# EAGLE design B301D (EAGLE 6.6.0)
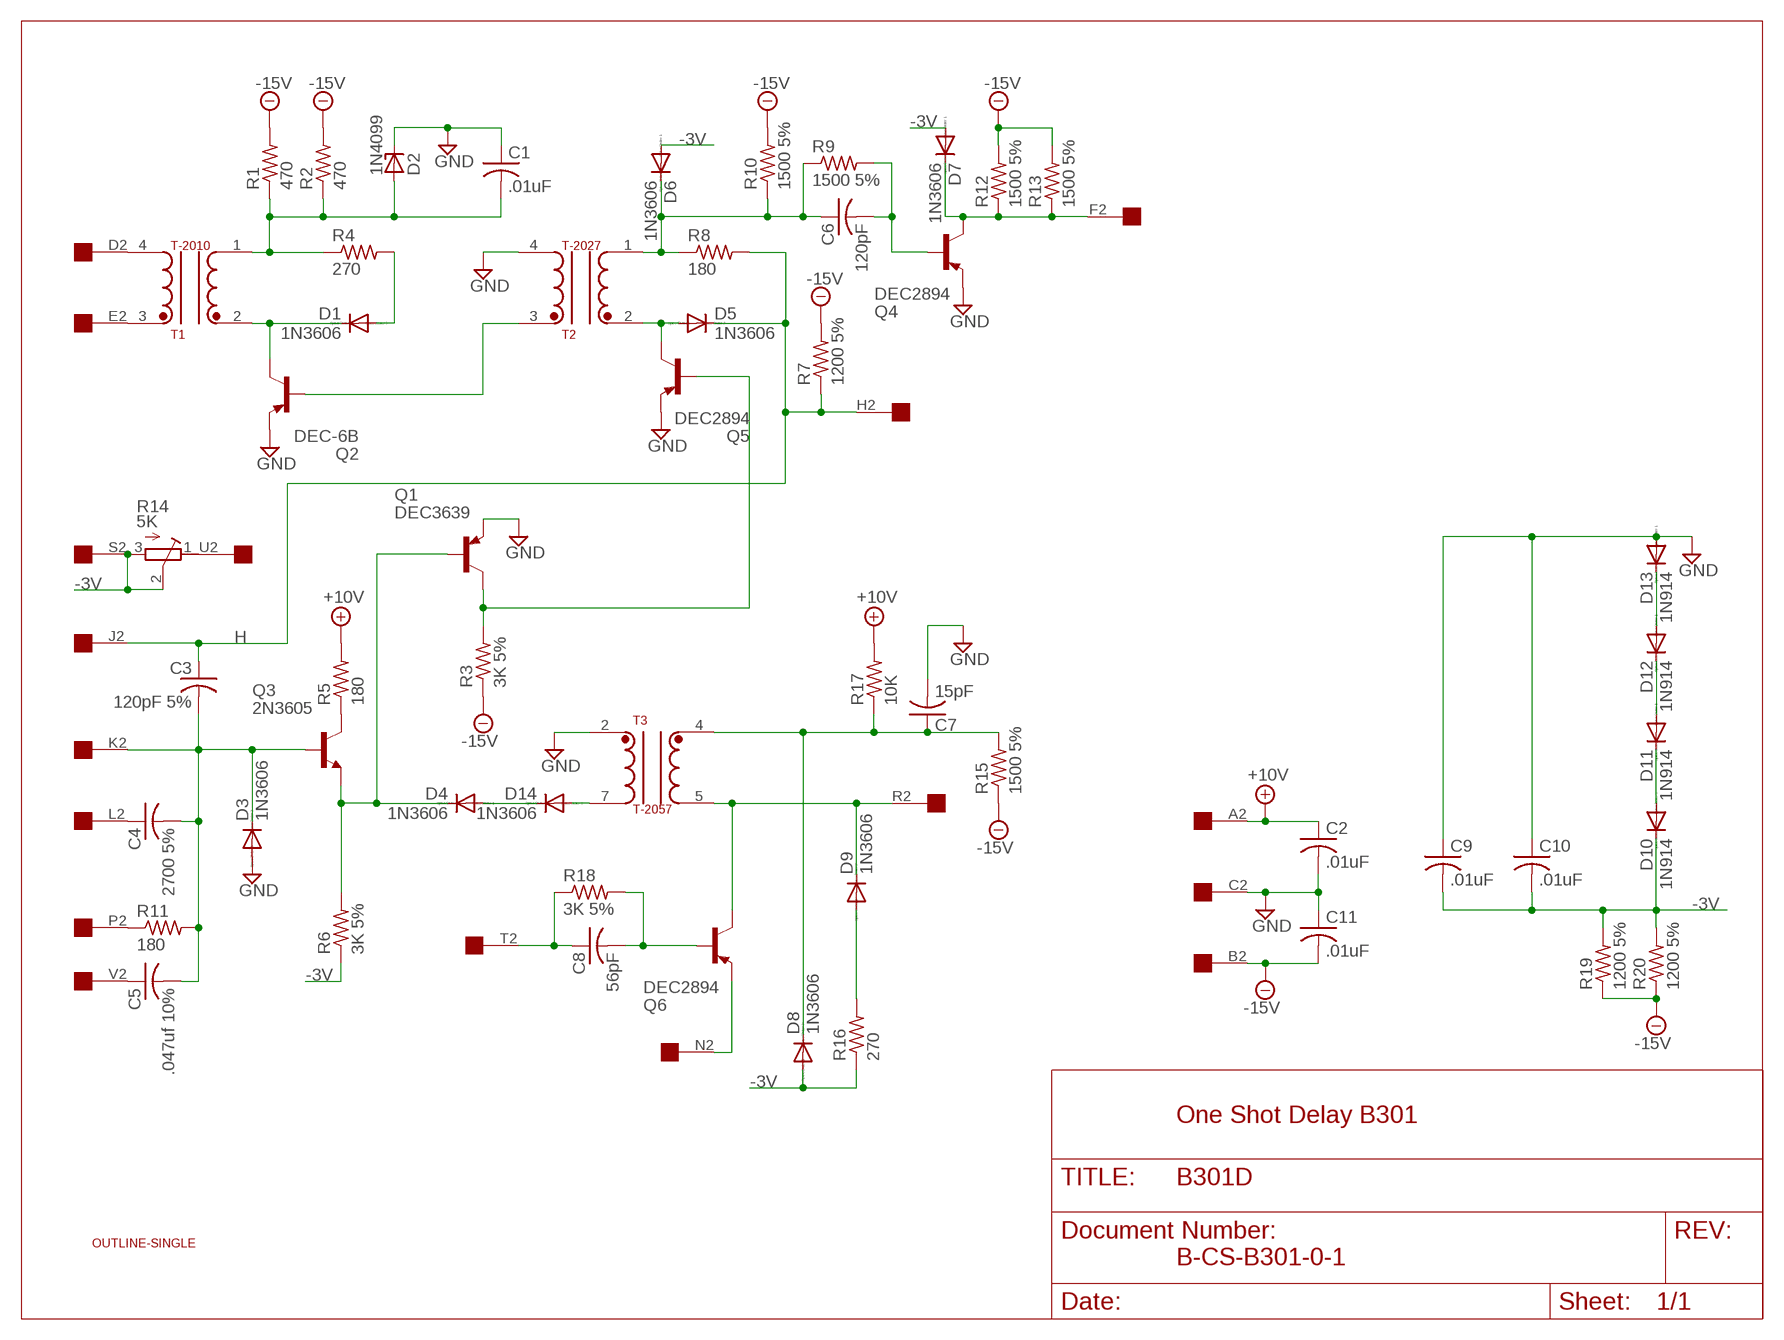
[diagram p0: schematic, sheet 1]

## Parts
C1  .01uF  C-US  [C063-025X075]
C2  .01uF  C-US  [C063-025X075]
C3  120pF 5%  C-US150-054X183  [C150-054X183]
C4  2700 5%  C-US102-043X133  [C102-043X133]
C5  .047uf 10%  C-US225-062X268  [C225-062X268]
C6  120pF  C-US150-054X183  [C150-054X183]
C7  15pF  C-US150-054X183  [C150-054X183]
C8  56pF  C-US150-054X183  [C150-054X183]
C9  .01uF  C-US  [C063-025X075]
C10  .01uF  C-US  [C063-025X075]
C11  .01uF  C-US  [C063-025X075]
D1  1N3606  1N4148DO35-10  [DO35-10]
D2  1N4099  ZENER-DIODEDO35Z10  [DO35Z10]
D3  1N3606  1N4148DO35-10  [DO35-10]
D4  1N3606  1N4148DO35-10  [DO35-10]
D5  1N3606  1N4148DO35-10  [DO35-10]
D6  1N3606  1N4148DO35-10  [DO35-10]
D7  1N3606  1N4148DO35-10  [DO35-10]
D8  1N3606  1N4148DO35-10  [DO35-10]
D9  1N3606  1N4148DO35-10  [DO35-10]
D10  1N914  1N4148DO35-10  [DO35-10]
D11  1N914  1N4148DO35-10  [DO35-10]
D12  1N914  1N4148DO35-10  [DO35-10]
D13  1N914  1N4148DO35-10  [DO35-10]
D14  1N3606  1N4148DO35-10  [DO35-10]
Q1  DEC3639  2N2904  [TO39]
Q2  DEC-6B  2N2904  [TO39]
Q3  2N3605  2N2102-NPN-TO39-EBC  [TO39]
Q4  DEC2894  2N2904  [TO39]
Q5  DEC2894  2N2904  [TO39]
Q6  DEC2894  2N2904  [TO39]
R1  470  R-US_0207/10  [0207/10]
R2  470  R-US_0207/10  [0207/10]
R3  3K 5%  R-US_0207/10  [0207/10]
R4  270  R-US_0207/10  [0207/10]
R5  180  R-US_0207/10  [0207/10]
R6  3K 5%  R-US_0207/10  [0207/10]
R7  1200 5%  R-US_0207/10  [0207/10]
R8  180  R-US_0207/10  [0207/10]
R9  1500 5%  R-US_0207/10  [0207/10]
R10  1500 5%  R-US_0207/10  [0207/10]
R11  180  R-US_0207/10  [0207/10]
R12  1500 5%  R-US_0207/10  [0207/10]
R13  1500 5%  R-US_0207/10  [0207/10]
R14  5K  275P  [3006Y]
R15  1500 5%  R-US_0207/10  [0207/10]
R16  270  R-US_0207/10  [0207/10]
R17  10K  R-US_0207/10  [0207/10]
R18  3K 5%  R-US_0207/10  [0207/10]
R19  1200 5%  R-US_0207/10  [0207/10]
R20  1200 5%  R-US_0207/10  [0207/10]
T1  T-2010  [TRANSFORMER2]
T2  T-2027  T-2010  [TRANSFORMER2]
T3  T-2057  T-2037  [TRANSFORMER]
U$1  OUTLINE-SINGLE  [SINGLE]
U$2  EDGE-1  [EDGE-CON1]

## Nets
+10V: C2.1 R5.2 R17.2 U$2.A2
-3V [Supply]: C9.2 C10.2 D6.A D7.A D8.A D10.C R6.1 R14.2(S) R14.3(E) R16.1 R19.2 R20.2 U$2.S2
-15V [Supply]: C11.2 R1.2 R2.2 R3.1 R7.2 R10.2 R12.2 R13.2 R15.1 R19.1 R20.1 U$2.B2
GND [Supply]: C1.1 C2.2 C7.2 C9.1 C10.1 C11.1 D2.C D3.A D13.A Q1.1(E) Q2.1(E) Q4.1(E) Q5.1(E) T2.4 T3.2 U$2.C2
H: C3.1 D5.C R7.1 R8.2 U$2.H2 U$2.J2
N$1: D7.C Q4.3(C) R12.1 R13.1 U$2.F2
N$2: C6.2 Q4.2(B) R9.2
N$3: D4.C Q1.2(B) Q3.1(E) R6.2
N$4: C3.2 C4.2 C5.2 D3.C Q3.2(B) R11.2 U$2.K2
N$5 [Supply]: R14.1(A) U$2.U2
N$6: C4.1 U$2.L2
N$7: C5.1 U$2.V2
N$8: Q2.2(B) T2.3
N$9: D1.C Q2.3(C) T1.2
N$10: R11.1 U$2.P2
N$11: Q3.3(C) R5.1
N$12: C1.2 D2.A R1.1 R2.1 R4.1 T1.1
N$13: D1.A R4.2
N$14: D5.A Q5.3(C) T2.2
N$15: D4.A D14.C
N$16: C6.1 D6.C R8.1 R9.1 R10.1 T2.1
N$17: Q1.3(C) Q5.2(B) R3.2
N$18: D14.A T3.7
N$19: D9.C Q6.3(C) T3.5 U$2.R2
N$20: Q6.1(E) U$2.N2
N$21: C8.2 Q6.2(B) R18.2
N$22: C8.1 R18.1 U$2.T2
N$23 [Supply]: C7.1 D8.C R15.2 R17.1 T3.4
N$24: D9.A R16.2
N$26: D12.A D13.C
N$27: D11.A D12.C
N$29: D10.A D11.C
N$41: T1.3 U$2.E2
N$42: T1.4 U$2.D2
Unconnected: U$2.M2

## Notes on the sheet
- One Shot Delay B301
- B-CS-B301-0-1

## Library data of the parts
C1 C2 C9-C11 = dec-con:C-US: Capacitors with funky DEC lead spacing.
C3-C8 = rcl:C-US: CAPACITOR, American symbol
D1 D3-D14 = diode:1N4148: DIODE high speed (Philips)
D2 = diode:ZENER-DIODE: Z-Diode
Q1 Q2 Q4-Q6 = transistor-pnp:2N2904*: PNP Transistror
Q3 = transistor:*-NPN-: NPN Transistror BF959 corrected 2008.03.06
R1-R13 R15-R20 = rcl:R-US_: RESISTOR, American symbol
R14 = dec-con:275P: Trimpot with 275P (3006Y) footprint.
T1 T2 = dec-con:T-2010: Button Transformer
T3 = dec-con:T-2037: T-2037 Transformer
U$1 = dec-con:OUTLINE-*: Board outlines for DEC boards.
U$2 = dec-con:EDGE-1: Single-Sided DEC Edge Connector -- (side 2)

## Net classes
0 default: width 0.813 mm
1 Supply: width 0.813 mm

## Board
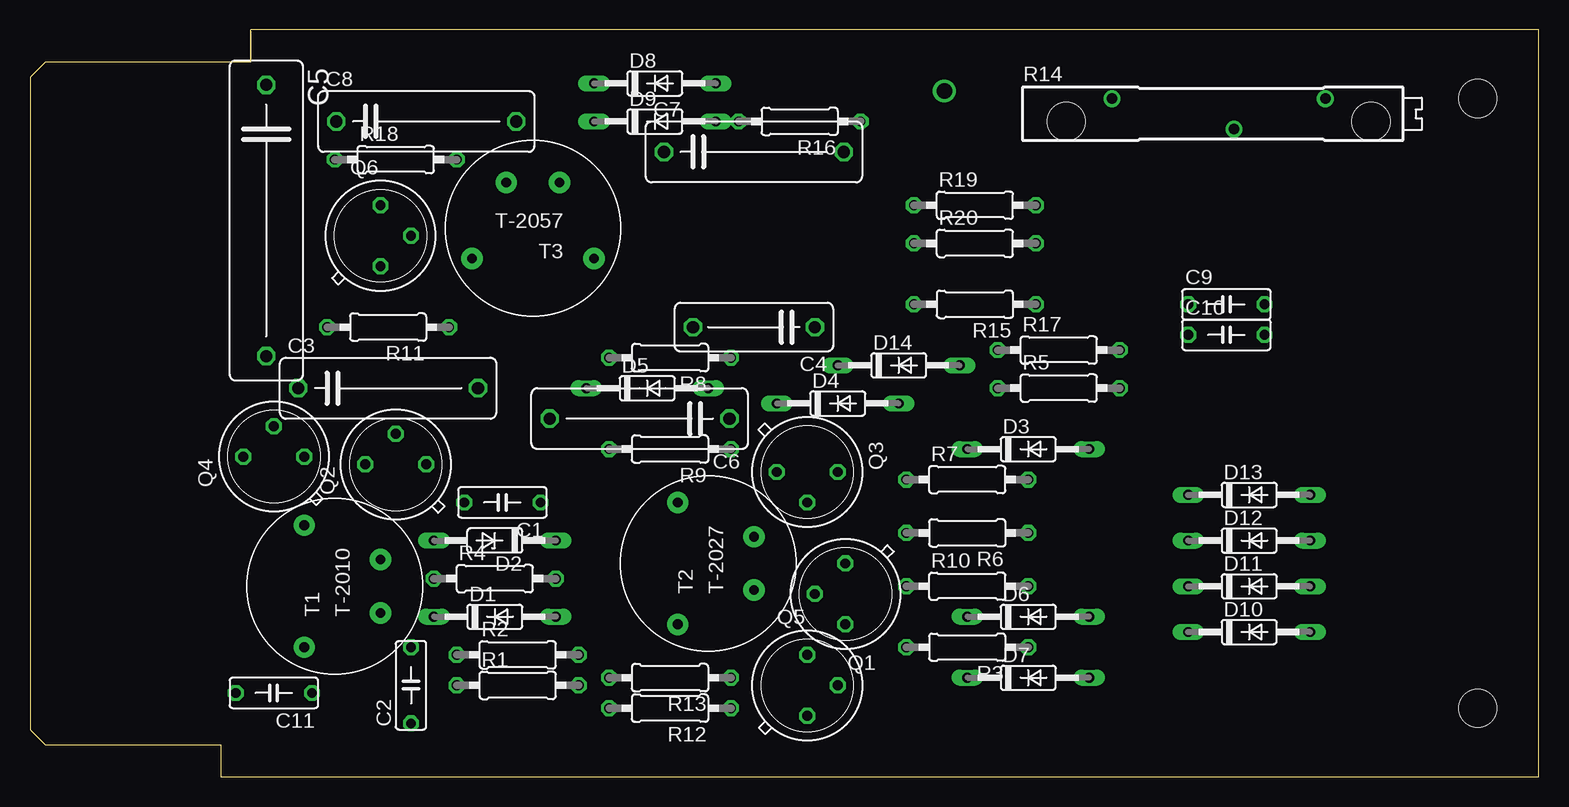
[diagram p1: board, top side]
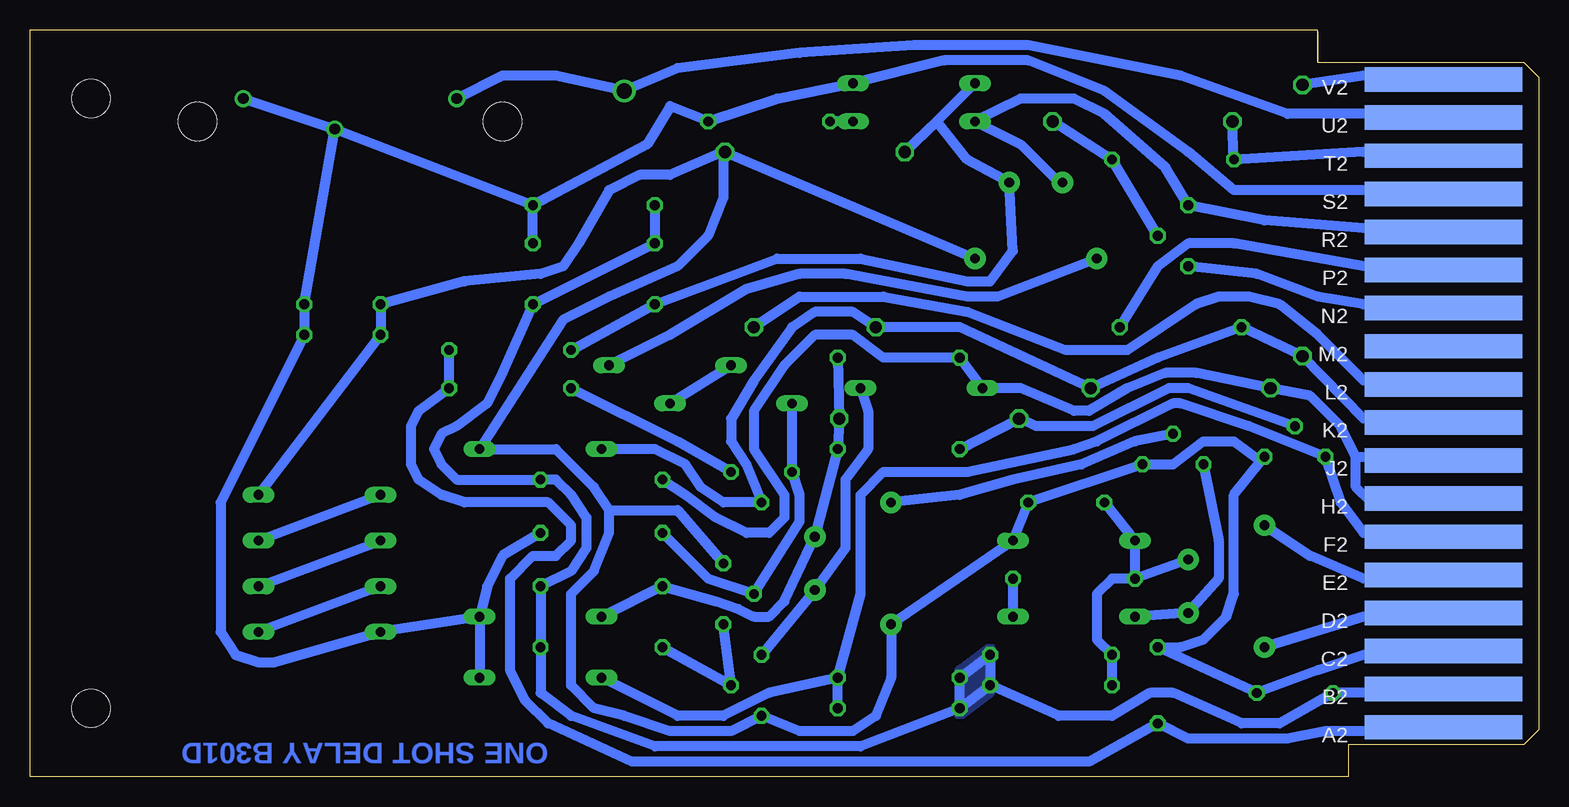
[diagram p2: board, bottom side, seen from below]

Size 125.73 x 62.23 mm. Coordinates in mm from the lower left corner, seen from the top.
Copper layers (1+16): Top 0.035mm / dielectric 1.5mm / Bottom 0.035mm
Design rules "16mils": minimum track width 16mil, minimum drill 32mil, track to track 15mil, track to pad 10mil, pad to pad 10mil, via to via 10mil, smd to smd 10mil, copper to edge 13mil, drill to drill 10mil, minimum pad ring 10mil, minimum via ring 8mil, stop-mask expansion 0mil, vias tented up to drill 0mil, thermal gap 10mil
Holes 3.17 mm at 111.76,54.61 86.36,54.61

### Footprints (pad centres in the part's own frame; a part is rotated, then mirrored left to right if it is on the bottom)
C063-025X075 = drill 0.813 octagon: 1 -2.54,0; 2 3.81,0
C150-054X183 = drill 1.016 octagon: 1 -7.493,0; 2 7.493,0
C102-043X133 = drill 1.016 octagon: 1 -5.08,0; 2 5.08,0
C225-062X268 = drill 1.016 octagon: 1 -11.303,0; 2 11.303,0
DO35-10 = drill 0.813 long: A 5.08,0; C -5.08,0
DO35Z10 = drill 0.813 long: A 5.08,0; C -5.08,0
TO39 = drill 0.813 octagon: 1 0,-2.54; 2 2.54,0; 3 0,2.54
0207/10 = drill 0.813 octagon: 1 -5.08,0; 2 5.08,0
3006Y = drill 0.9: 1 -8.89,1.27; 2 1.27,-1.27; 3 8.89,1.27
TRANSFORMER2 = drill 0.813 pad 1.778: 1 2.223,-3.81; 2 -2.223,-3.81; 3 5.08,2.54; 4 -5.08,2.54
TRANSFORMER = drill 0.813 pad 1.778: 2 -5.08,2.54; 4 -2.223,-3.81; 5 2.223,-3.81; 7 5.08,2.54
SINGLE = hole 3.175: 120.65,56.515; 120.65,5.715
EDGE-CON1 = smd 13.106 x 2.032 bottom: A2 7.938,4.128; B2 7.938,7.303; C2 7.938,10.477; D2 7.938,13.652; E2 7.938,16.828; F2 7.938,20.003; H2 7.938,23.177; J2 7.938,26.352; K2 7.938,29.527; L2 7.938,32.703; M2 7.938,35.877; N2 7.938,39.053; P2 7.938,42.227; R2 7.938,45.403; S2 7.938,48.578; T2 7.938,51.752; U2 7.938,54.928; V2 7.938,58.102

### Placement (x,y rotation side)
C1  40.01,22.86 180 top
C2  31.75,6.99 90 top
C3  29.85,32.38 0 top
C4  60.33,37.47 180 top
C5  19.69,46.35 270 top
C6  50.8,29.84 180 top
C7  60.33,52.07 0 top
C8  33.02,54.61 0 top
C9  99.06,39.37 0 top
C10  99.06,36.83 0 top
C11  20.96,6.99 180 top
D1  38.74,13.34 0 top
D2  38.74,19.68 180 top
D3  83.19,27.3 0 top
D4  67.31,31.11 0 top
D5  51.44,32.38 0 top
D6  83.19,13.34 0 top
D7  83.19,8.26 0 top
D8  52.07,57.78 0 top
D9  52.07,54.61 0 top
D10  101.6,12.06 0 top
D11  101.6,15.88 0 top
D12  101.6,19.68 0 top
D13  101.6,23.5 0 top
D14  72.39,34.29 0 top
Q1  67.95,15.24 180 top
Q2  30.48,26.04 90 top
Q3  64.77,25.4 270 top
Q4  20.32,26.67 90 top
Q5  64.77,7.62 0 top
Q6  29.21,45.09 0 top
R1  40.64,7.62 0 top
R2  40.64,10.16 0 top
R3  78.11,10.79 180 top
R4  38.74,16.51 0 top
R5  85.73,32.38 0 top
R6  78.11,20.32 180 top
R7  78.11,24.77 0 top
R8  53.34,34.92 180 top
R9  53.34,27.3 180 top
R10  78.11,15.88 0 top
R11  29.85,37.47 180 top
R12  53.34,5.71 180 top
R13  53.34,8.26 180 top
R14  99.06,55.24 0 top
R15  78.74,39.37 180 top
R16  64.14,54.61 180 top
R17  85.73,35.56 0 top
R18  30.48,51.44 0 top
R19  78.74,47.62 0 top
R20  78.74,44.45 0 top
T1  25.4,15.88 90 top
T2  56.52,17.78 90 top
T3  41.91,45.72 180 top
U$1  0,0 0 top
U$2  0,0 0 top

### Tracks (layer width: path | path; a pad name or v marks a point on that pad's centre or on a via)
+10V
  Bottom 0.813: U$2.A2 8.89,3.81 17.78,3.81 20.96,3.17 22.23,3.17 29.21,3.17 C2.1 37.47,1.27 75.57,1.27 82.55,4.45 84.46,6.35 85.73,8.89 85.73,16.51 83.82,18.41 81.92,18.41 80.65,19.68 80.65,20.95 82.55,22.86 89.54,22.86 91.44,23.5 93.35,24.77 93.98,26.04 93.98,29.21 93.35,30.48 R5.2 R17.2
-3V
  Bottom 0.813: R19.2 74.3,52.7 72.39,55.88 R16.1 63.5,56.52 D8.A 49.53,59.69 42.55,59.69 36.2,57.15 29.21,52.07 25.4,48.9 8.26,48.9 U$2.S2 | R19.2 R14.2 | R14.3 R14.2 | R14.2 C9.2 C10.2 109.86,22.86 109.86,12.06 108.59,10.16 106.68,9.53 105.41,9.53 D10.C D6.A | R20.2 R19.2 | D6.A D7.A | R6.1 86.36,18.41 87.63,15.88 D6.A
-15V
  Bottom 0.813: U$2.B2 9.53,6.99 C11.2 21.59,4.45 24.77,4.45 30.48,6.99 32.39,6.99 35.56,5.08 40.01,5.08 R1.2 | R1.2 R2.2 R13.2 R12.2 | R12.2 R1.2 | R12.2 56.52,2.54 73.66,2.54 80.65,5.08 83.19,6.99 R3.1 R10.2 80.65,17.14 79.38,19.05 79.38,21.59 80.65,23.5 81.92,24.77 R7.2 90.17,24.77 91.44,26.04 92.08,27.3 91.44,28.57 90.17,29.21 87.63,31.11 86.36,33.66 R15.1 R20.1 R19.1
  pour Bottom (no thermals): 45.72,7.62 45.72,6.99 48.26,5.08 48.26,8.89 45.72,10.79
GND
  Bottom 0.813: U$2.C2 8.89,10.16 14.61,10.16 18.42,8.89 C11.1 C2.2 29.85,10.79 27.94,11.43 26.04,13.34 25.4,15.24 25.4,23.5 23.17,26.28 | 23.17,26.28 Q4.1 | 23.17,26.28 25.4,27.94 27.94,27.94 30.48,26.04 Q2.1 C1.1 D2.C T2.4 53.98,8.26 55.25,5.08 57.15,3.81 61.6,3.81 Q5.1 67.31,3.81 72.39,3.81 76.2,5.08 78.74,5.71 80.65,7.62 80.65,15.24 78.74,17.14 77.47,20.32 77.47,22.23 | T3.2 67.95,52.07 | 67.95,52.07 72.39,50.16 74.93,50.16 77.47,48.9 80.01,44.45 81.28,42.55 83.19,41.91 89.54,41.27 C9.1 C10.1 D13.A | 67.95,52.07 67.95,48.26 69.22,45.09 71.76,42.55 77.47,40.01 81.28,38.1 D3.A 81.92,27.3 78.74,24.13 77.47,22.23 | 77.47,22.23 71.76,22.23 Q1.1 | 67.95,52.07 C7.2
H
  Bottom 0.813: U$2.H2 7.62,22.86 13.97,22.86 15.24,24.13 15.24,26.67 | 15.24,26.67 8.89,26.67 U$2.J2 | 15.24,26.67 16.51,29.21 19.05,31.75 C3.1 28.58,33.66 31.12,33.66 34.29,32.38 37.47,30.48 38.74,30.48 43.18,32.38 D5.C R8.2 54.61,34.92 57.15,36.83 60.33,36.83 62.87,34.29 65.41,30.48 65.41,27.3 62.87,23.5 62.87,21.59 64.14,20.32 66.04,20.32 68.58,21.59 71.12,23.5 R7.1
N$1
  Bottom 0.813: U$2.F2 8.89,20.32 14.61,20.32 16.51,22.86 Q4.3 24.13,29.21 29.85,31.11 30.48,31.11 36.83,27.94 38.74,27.3 47.63,25.4 54.61,25.4 56.52,23.5 56.52,15.24 R13.1 | R12.1 R13.1 | R13.1 64.14,6.99 67.95,5.08 71.76,5.08 D7.C
N$2
  Bottom 0.813: Q4.2 29.21,32.38 30.8,32.38 37.15,29.21 41.91,29.21 43.18,29.84 C6.2 R9.2
N$3
  Bottom 0.813: R6.2 69.22,16.51 Q1.2 61.6,21.27 61.6,23.5 Q3.1 D4.C
N$4
  Bottom 0.813: U$2.K2 8.89,29.84 14.61,29.84 C5.2 R11.2 31.75,34.92 C3.2 48.26,37.47 C4.2 57.15,38.73 60.33,38.73 62.23,37.47 65.41,33.02 67.31,29.84 67.31,27.94 66.04,26.04 Q3.2 67.95,22.86 69.85,24.13 71.12,26.04 73.66,27.3 D3.C
N$5  (via drill 1.27)
  Bottom 0.813: U$2.U2 8.89,55.24 20.96,55.24 29.85,58.42 42.55,60.96 52.07,60.96 61.6,60.33 71.76,59.05 v76.2,57.15 81.92,58.42 86.36,58.42 R14.1
N$6
  Bottom 0.813: U$2.L2 8.89,33.02 14.61,33.02 18.42,36.83 21.59,39.37 24.13,40.01 26.67,40.01 28.58,39.37 34.29,35.56 39.37,35.56 47.63,38.73 54.61,40.01 61.6,40.01 C4.1
N$7
  Bottom 0.813: U$2.V2 8.89,58.42 14.61,58.42 C5.1
N$8
  Bottom 0.813: Q2.2 33.66,27.94 38.1,26.04 43.82,24.77 48.26,23.5 T2.3
N$9
  Bottom 0.813: Q2.3 26.67,19.68 26.67,16.51 T1.2 D1.C
N$10
  Bottom 0.813: U$2.P2 8.89,42.55 14.61,42.55 25.4,44.45 29.21,44.45 31.75,42.55 R11.1
N$11
  Bottom 0.813: R5.1 71.76,27.94 Q3.3
N$12
  Bottom 0.813: T1.1 R4.1 | R1.1 R2.1 36.83,11.43 36.83,15.24 35.56,16.51 R4.1 | R4.1 D2.A C1.2
N$13
  Bottom 0.813: R4.2 D1.A
N$14
  Bottom 0.813: Q5.3 T2.2 57.79,19.05 57.79,24.77 55.88,27.3 55.88,30.48 D5.A
N$15
  Bottom 0.813: D14.C D4.A
N$16
  Bottom 0.813: R8.1 C6.1 R9.1 T2.1 62.87,14.61 64.14,13.34 65.41,13.34 66.68,13.97 68.58,14.61 R10.1 D6.C
N$17
  Bottom 0.813: Q1.3 Q5.2 R3.2
N$18
  Bottom 0.813: T3.7 45.09,40.01 47.63,40.01 57.79,41.91 61.6,41.91 66.04,40.64 72.39,36.83 D14.A
N$19
  Bottom 0.813: U$2.R2 10.16,45.72 14.61,45.72 22.86,46.35 Q6.3 31.12,50.8 36.2,55.24 38.74,56.52 43.18,56.52 D9.C 43.18,52.7 40.01,49.53 T3.5
N$20
  Bottom 0.813: U$2.N2 9.53,39.37 14.61,39.37 18.42,40.01 23.5,41.91 Q6.1
N$21
  Bottom 0.813: Q6.2 R18.2 C8.2
N$22
  Bottom 0.813: U$2.T2 8.89,52.07 14.61,52.07 R18.1 C8.1
N$23
  Bottom 0.813: 50.17,54.61 47.63,51.44 T3.4 43.82,43.81 45.72,41.27 47.63,41.27 56.52,43.18 63.5,43.18 R15.2 R17.1 | 50.17,54.61 D8.C | 50.17,54.61 C7.1
N$24
  Bottom 0.813: D9.A R16.2
N$26
  Bottom 0.813: D13.C D12.A
N$27
  Bottom 0.813: D11.A D12.C
N$29
  Bottom 0.813: D11.C D10.A
N$41
  Bottom 0.813: U$2.E2 9.53,16.51 14.61,16.51 19.05,18.41 T1.3
N$42
  Bottom 0.813: U$2.D2 8.89,13.34 14.61,13.34 T1.4

### Text on the board
Bottom: ONE SHOT DELAY B301D
200bmp: C:/Users/Vince/Documents/eagle/projects/DEC/Bxxx/B301/B301Dbackfb.bmp